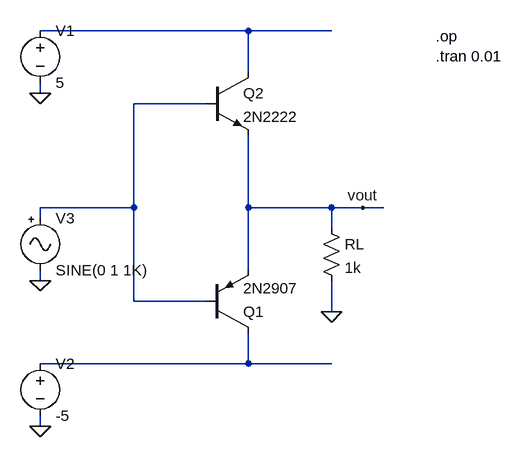
[diagram p0: schematic test 7 first half not improved design.asc]
test 7 first half not improved design.asc, the LTspice schematic file:
Version 4
SHEET 1 880 784
WIRE 352 160 32 160
WIRE 480 160 352 160
WIRE 352 224 352 160
WIRE 32 256 32 240
WIRE 288 272 176 272
WIRE 176 432 176 272
WIRE 176 432 32 432
WIRE 352 432 352 320
WIRE 480 432 352 432
WIRE 528 432 480 432
WIRE 560 432 528 432
WIRE 32 448 32 432
WIRE 480 464 480 432
WIRE 352 528 352 432
WIRE 32 544 32 528
WIRE 176 576 176 432
WIRE 288 576 176 576
WIRE 480 592 480 544
WIRE 352 672 352 624
WIRE 352 672 32 672
WIRE 480 672 352 672
WIRE 32 768 32 752
FLAG 480 592 0
FLAG 32 256 0
FLAG 32 768 0
FLAG 32 544 0
FLAG 528 432 vout
SYMBOL npn 288 224 R0
SYMATTR InstName Q2
SYMATTR Value 2N2222
SYMBOL res 464 448 R0
SYMATTR InstName RL
SYMATTR Value 1k
SYMBOL voltage 32 144 R0
SYMATTR InstName V1
SYMATTR Value 5
SYMBOL voltage 32 656 R0
SYMATTR InstName V2
SYMATTR Value -5
SYMBOL pnp 288 624 M180
SYMATTR InstName Q1
SYMATTR Value 2N2907
SYMBOL Misc/signal 32 432 R0
SYMATTR InstName V3
TEXT 640 168 Left 2 !.op\n.tran 0.01

The netlist it stands for:
* test 7 first half not improved design.asc
Q2 N001 N002 vout 0 2N2222
RL vout 0 1k
V1 N001 0 5
V2 N003 0 -5
Q1 N003 N002 vout 0 2N2907
V3 N002 0 SINE(0 1 1K)
.model NPN NPN
.model PNP PNP
.lib standard.bjt
.op
.tran 0.01
.backanno
.end